# Altium schematic sheet 00_cover_sheet.SchDoc
size A3; SheetNumber: 1; SheetTotal: 17
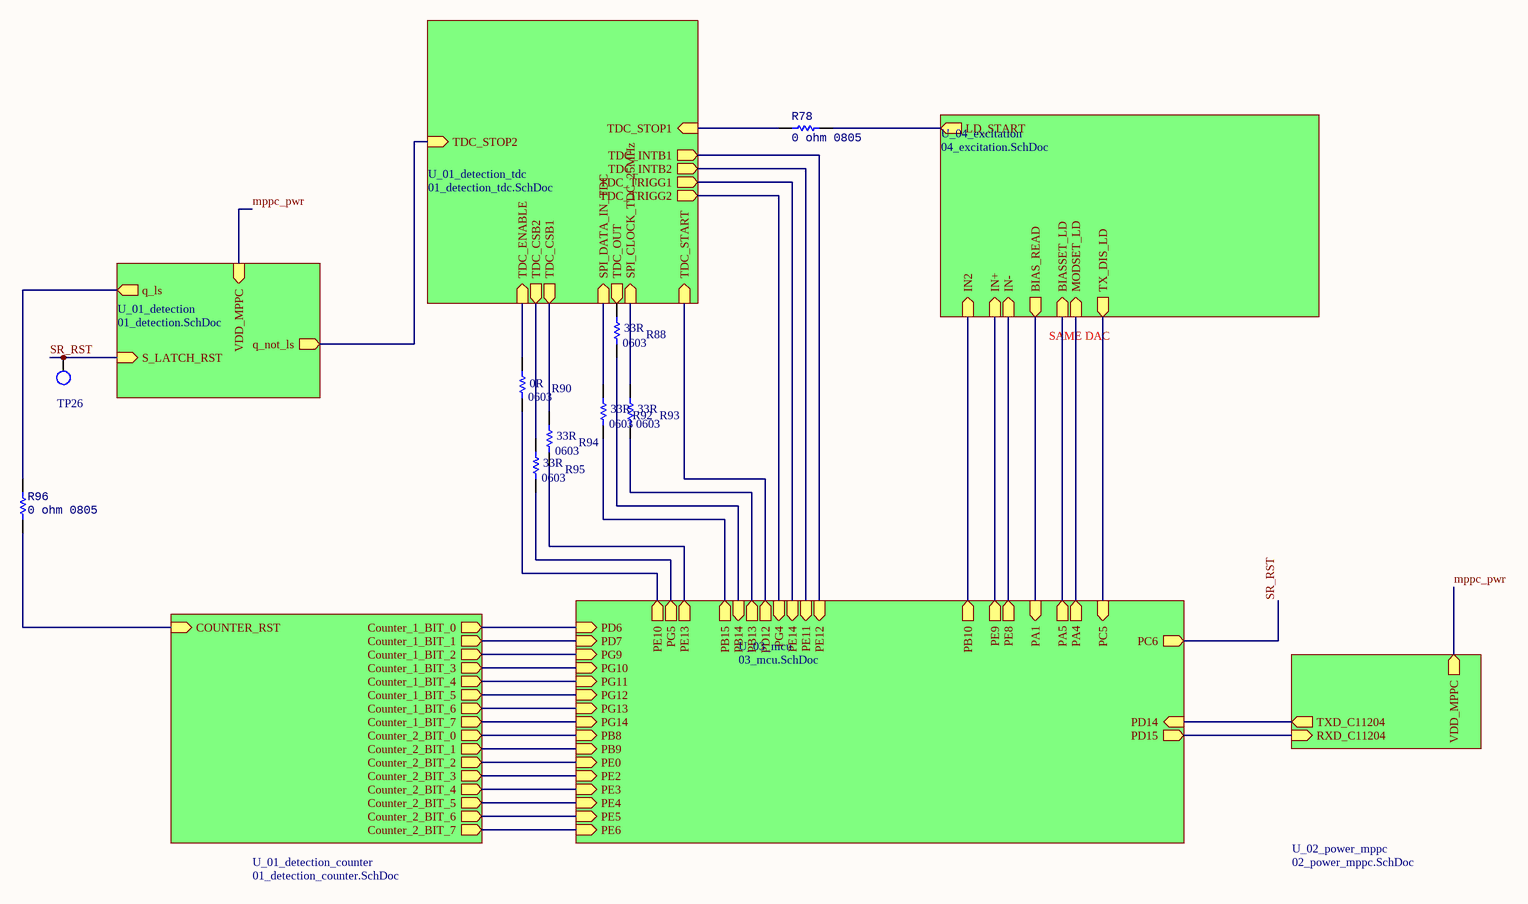
[diagram p0: 00_cover_sheet.SchDoc]

## Parts
R78  0 ohm 0805  [RES-STACK-POLE-0805]
R88  RMCF0603JT33R0  [RES-STACK-POLE-0603]  (value not drawn)
R90  RMCF0603ZT0R00  [RES-STACK-POLE-0603]  (value not drawn)
R92  RMCF0603JT33R0  [RES-STACK-POLE-0603]  (value not drawn)
R93  RMCF0603JT33R0  [RES-STACK-POLE-0603]  (value not drawn)
R94  RMCF0603JT33R0  [RES-STACK-POLE-0603]  (value not drawn)
R95  RMCF0603JT33R0  [RES-STACK-POLE-0603]  (value not drawn)
R96  0 ohm 0805  [RES-STACK-POLE-0805]
TP26  TESTPOINT_S  [TESTPOINT_S]  (value not drawn)  (no BOM)

## Sub-sheets
U_01_detection = 01_detection.SchDoc: VDD_MPPC (in), S_LATCH_RST (in), q_ls (out), q_not_ls (out)
U_01_detection_counter = 01_detection_counter.SchDoc: COUNTER_RST (in), Counter_1_BIT_0 (out), Counter_1_BIT_1 (out), Counter_1_BIT_2 (out), Counter_1_BIT_3 (out), Counter_1_BIT_4 (out), Counter_1_BIT_5 (out), Counter_1_BIT_6 (out), Counter_1_BIT_7 (out), Counter_2_BIT_0 (out), Counter_2_BIT_1 (out), Counter_2_BIT_2 (out), Counter_2_BIT_3 (out), Counter_2_BIT_4 (out), Counter_2_BIT_5 (out), Counter_2_BIT_6 (out), Counter_2_BIT_7 (out)
U_01_detection_tdc = 01_detection_tdc.SchDoc: TDC_ENABLE (in), SPI_CLOCK_TDC_25MHz (in), SPI_DATA_IN_TDC (in), TDC_INTB1 (out), TDC_INTB2 (out), TDC_TRIGG1 (out), TDC_TRIGG2 (out), TDC_CSB1 (out), TDC_CSB2 (out), TDC_STOP2 (in), TDC_STOP1 (in), TDC_START (in), TDC_OUT (out)
U_02_power_mppc = 02_power_mppc.SchDoc: RXD_C11204 (in), TXD_C11204 (out), VDD_MPPC (out)
U_03_mcu = 03_mcu.SchDoc: PE2 (in), PE3 (in), PE4 (in), PE5 (in), PE6 (in), PB10 (out), PE14 (in), PE13 (out), PE12 (in), PE11 (in), PE10 (out), PE9 (out), PE8 (out), PC5 (in), PA5 (out), PA4 (out), PB13 (out), PB14 (in), PB15 (out), PD12 (out), PD14 (in), PD15 (out), PG4 (in), PG5 (out), PC6 (out), PD6 (in), PD7 (in), PG9 (in), PG10 (in), PG11 (in), PG12 (in), PG13 (in), PG14 (in), PB8 (in), PB9 (in), PE0 (in), PA1 (in)
U_04_excitation = 04_excitation.SchDoc: MODSET_LD (in), BIASSET_LD (in), TX_DIS_LD (out), IN- (in), BIAS_READ (out), IN2 (in), IN+ (in), LD_START (out)

## Nets
mppc_pwr: sheet U_01_detection/VDD_MPPC, sheet U_02_power_mppc/VDD_MPPC
SR_RST: TP26.1 ; sheet U_01_detection/S_LATCH_RST, sheet U_03_mcu/PC6
NetR78_1: R78.1 ; sheet U_01_detection_tdc/TDC_STOP1
NetR78_2: R78.2 ; sheet U_04_excitation/LD_START
NetR88_1: R88.1 ; sheet U_03_mcu/PB14
NetR88_2: R88.2 ; sheet U_01_detection_tdc/TDC_OUT
NetR90_1: R90.1 ; sheet U_03_mcu/PE10
NetR90_2: R90.2 ; sheet U_01_detection_tdc/TDC_ENABLE
NetR92_1: R92.1 ; sheet U_03_mcu/PB15
NetR92_2: R92.2 ; sheet U_01_detection_tdc/SPI_DATA_IN_TDC
NetR93_1: R93.1 ; sheet U_03_mcu/PB13
NetR93_2: R93.2 ; sheet U_01_detection_tdc/SPI_CLOCK_TDC_25MHz
NetR94_1: R94.1 ; sheet U_03_mcu/PE13
NetR94_2: R94.2 ; sheet U_01_detection_tdc/TDC_CSB1
NetR95_1: R95.1 ; sheet U_03_mcu/PG5
NetR95_2: R95.2 ; sheet U_01_detection_tdc/TDC_CSB2
NetR96_1: R96.1 ; sheet U_01_detection_counter/COUNTER_RST
NetR96_2: R96.2 ; sheet U_01_detection/q_ls
(unnamed): sheet U_01_detection/q_not_ls, sheet U_01_detection_tdc/TDC_STOP2
(unnamed): sheet U_02_power_mppc/RXD_C11204, sheet U_03_mcu/PD15
(unnamed): sheet U_02_power_mppc/TXD_C11204, sheet U_03_mcu/PD14
(unnamed): sheet U_01_detection_tdc/TDC_INTB1, sheet U_03_mcu/PE12
(unnamed): sheet U_01_detection_tdc/TDC_INTB2, sheet U_03_mcu/PE11
(unnamed): sheet U_01_detection_tdc/TDC_TRIGG1, sheet U_03_mcu/PE14
(unnamed): sheet U_01_detection_tdc/TDC_TRIGG2, sheet U_03_mcu/PG4
(unnamed): sheet U_01_detection_tdc/TDC_START, sheet U_03_mcu/PD12
(unnamed): sheet U_04_excitation/MODSET_LD, sheet U_03_mcu/PA4
(unnamed): sheet U_04_excitation/BIASSET_LD, sheet U_03_mcu/PA5
(unnamed): sheet U_04_excitation/TX_DIS_LD, sheet U_03_mcu/PC5
(unnamed): sheet U_04_excitation/IN-, sheet U_03_mcu/PE8
(unnamed): sheet U_04_excitation/BIAS_READ, sheet U_03_mcu/PA1
(unnamed): sheet U_04_excitation/IN2, sheet U_03_mcu/PB10
(unnamed): sheet U_04_excitation/IN+, sheet U_03_mcu/PE9
(unnamed): sheet U_03_mcu/PE2, sheet U_01_detection_counter/Counter_2_BIT_3
(unnamed): sheet U_03_mcu/PE3, sheet U_01_detection_counter/Counter_2_BIT_4
(unnamed): sheet U_03_mcu/PE4, sheet U_01_detection_counter/Counter_2_BIT_5
(unnamed): sheet U_03_mcu/PE5, sheet U_01_detection_counter/Counter_2_BIT_6
(unnamed): sheet U_03_mcu/PE6, sheet U_01_detection_counter/Counter_2_BIT_7
(unnamed): sheet U_03_mcu/PD6, sheet U_01_detection_counter/Counter_1_BIT_0
(unnamed): sheet U_03_mcu/PD7, sheet U_01_detection_counter/Counter_1_BIT_1
(unnamed): sheet U_03_mcu/PG9, sheet U_01_detection_counter/Counter_1_BIT_2
(unnamed): sheet U_03_mcu/PG10, sheet U_01_detection_counter/Counter_1_BIT_3
(unnamed): sheet U_03_mcu/PG11, sheet U_01_detection_counter/Counter_1_BIT_4
(unnamed): sheet U_03_mcu/PG12, sheet U_01_detection_counter/Counter_1_BIT_5
(unnamed): sheet U_03_mcu/PG13, sheet U_01_detection_counter/Counter_1_BIT_6
(unnamed): sheet U_03_mcu/PG14, sheet U_01_detection_counter/Counter_1_BIT_7
(unnamed): sheet U_03_mcu/PB8, sheet U_01_detection_counter/Counter_2_BIT_0
(unnamed): sheet U_03_mcu/PB9, sheet U_01_detection_counter/Counter_2_BIT_1
(unnamed): sheet U_03_mcu/PE0, sheet U_01_detection_counter/Counter_2_BIT_2

## Notes on the sheet
- SAME DAC
- (in symbol RMCF0603JT33R0) 33R; 0603
- (in symbol RMCF0603ZT0R00) 0R; 0603

## Library data of the parts
R78 R96 = RC0805JR-070RL: RES 0 OHM JUMPER 1/8W 0805; Supplier 1: Digikey; Supplier Part Number 1: 311-0.0ARCT-ND
R88 R92-R95 = RMCF0603JT33R0: RES 33 OHM 5% 1/10W 0603; Supplier 1: Digi-Key; Supplier Part Number 1: RMCF0603JT33R0CT-ND
R90 = RMCF0603ZT0R00: RES 0 OHM JUMPER 1/10W 0603; Supplier 1: Digi-Key; Supplier Part Number 1: RMCF0603ZT0R00CT-ND
TP26 = TESTPOINT_S: Testpoint Surface Pad